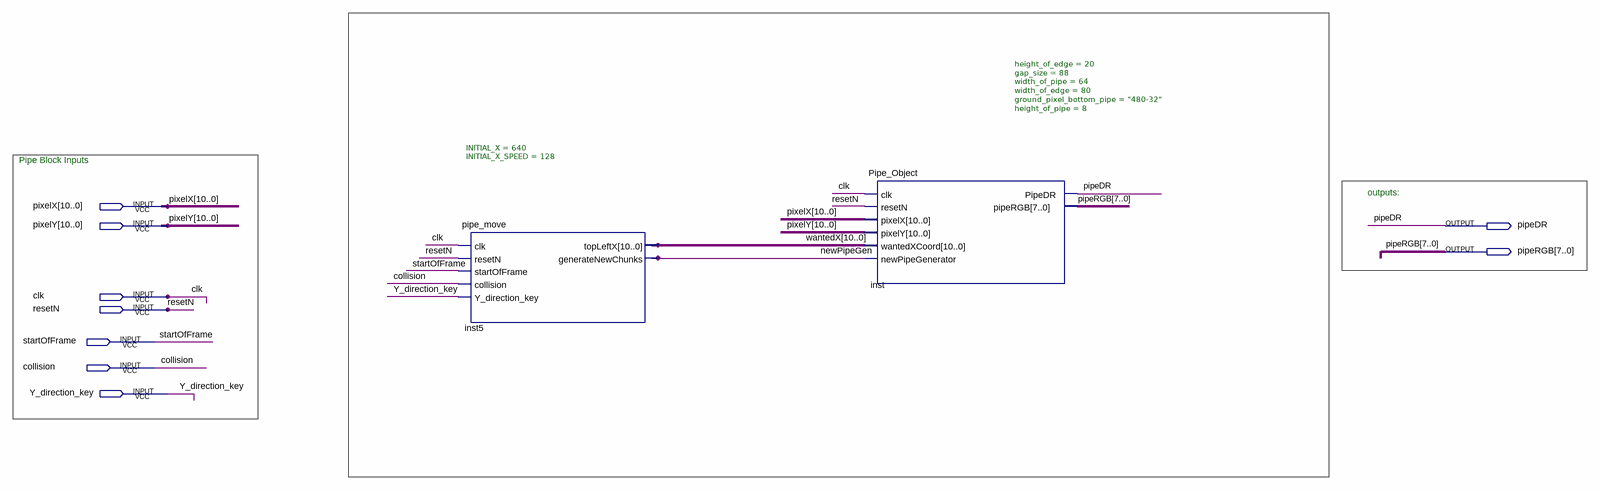
[diagram p0: schematic sheet]
// Quartus schematic Pipes_Block_T.bdf as structural Verilog: 2 symbols, 9 pins
module Pipes_Block_T (
  input  [10:0] pixelX,
  input  [10:0] pixelY,
  input  clk,
  input  resetN,
  input  startOfFrame,
  input  collision,
  input  Y_direction_key,
  output pipeDR,
  output [7:0] pipeRGB
);

  wire newPipeGen;
  wire [10:0] wantedX;

  pipe_move #(.INITIAL_X(640), .INITIAL_X_SPEED(128)) inst5 (
    .clk(clk), .resetN(resetN), .startOfFrame(startOfFrame), .collision(collision),
    .Y_direction_key(Y_direction_key), .topLeftX(wantedX), .generateNewChunks(newPipeGen));
  Pipe_Object #(.height_of_edge(20), .gap_size(88), .width_of_pipe(64), .width_of_edge(80), .ground_pixel_bottom_pipe("480-32"), .height_of_pipe(8)) inst (
    .clk(clk), .resetN(resetN), .pixelX(pixelX), .pixelY(pixelY), .wantedXCoord(wantedX),
    .newPipeGenerator(newPipeGen), .PipeDR(pipeDR), .pipeRGB(pipeRGB));

  // Notes on the sheet:
  //   Pipe Block Inputs
  //   outputs:
endmodule
